# Altium schematic sheet POWER.SchDoc
size A2
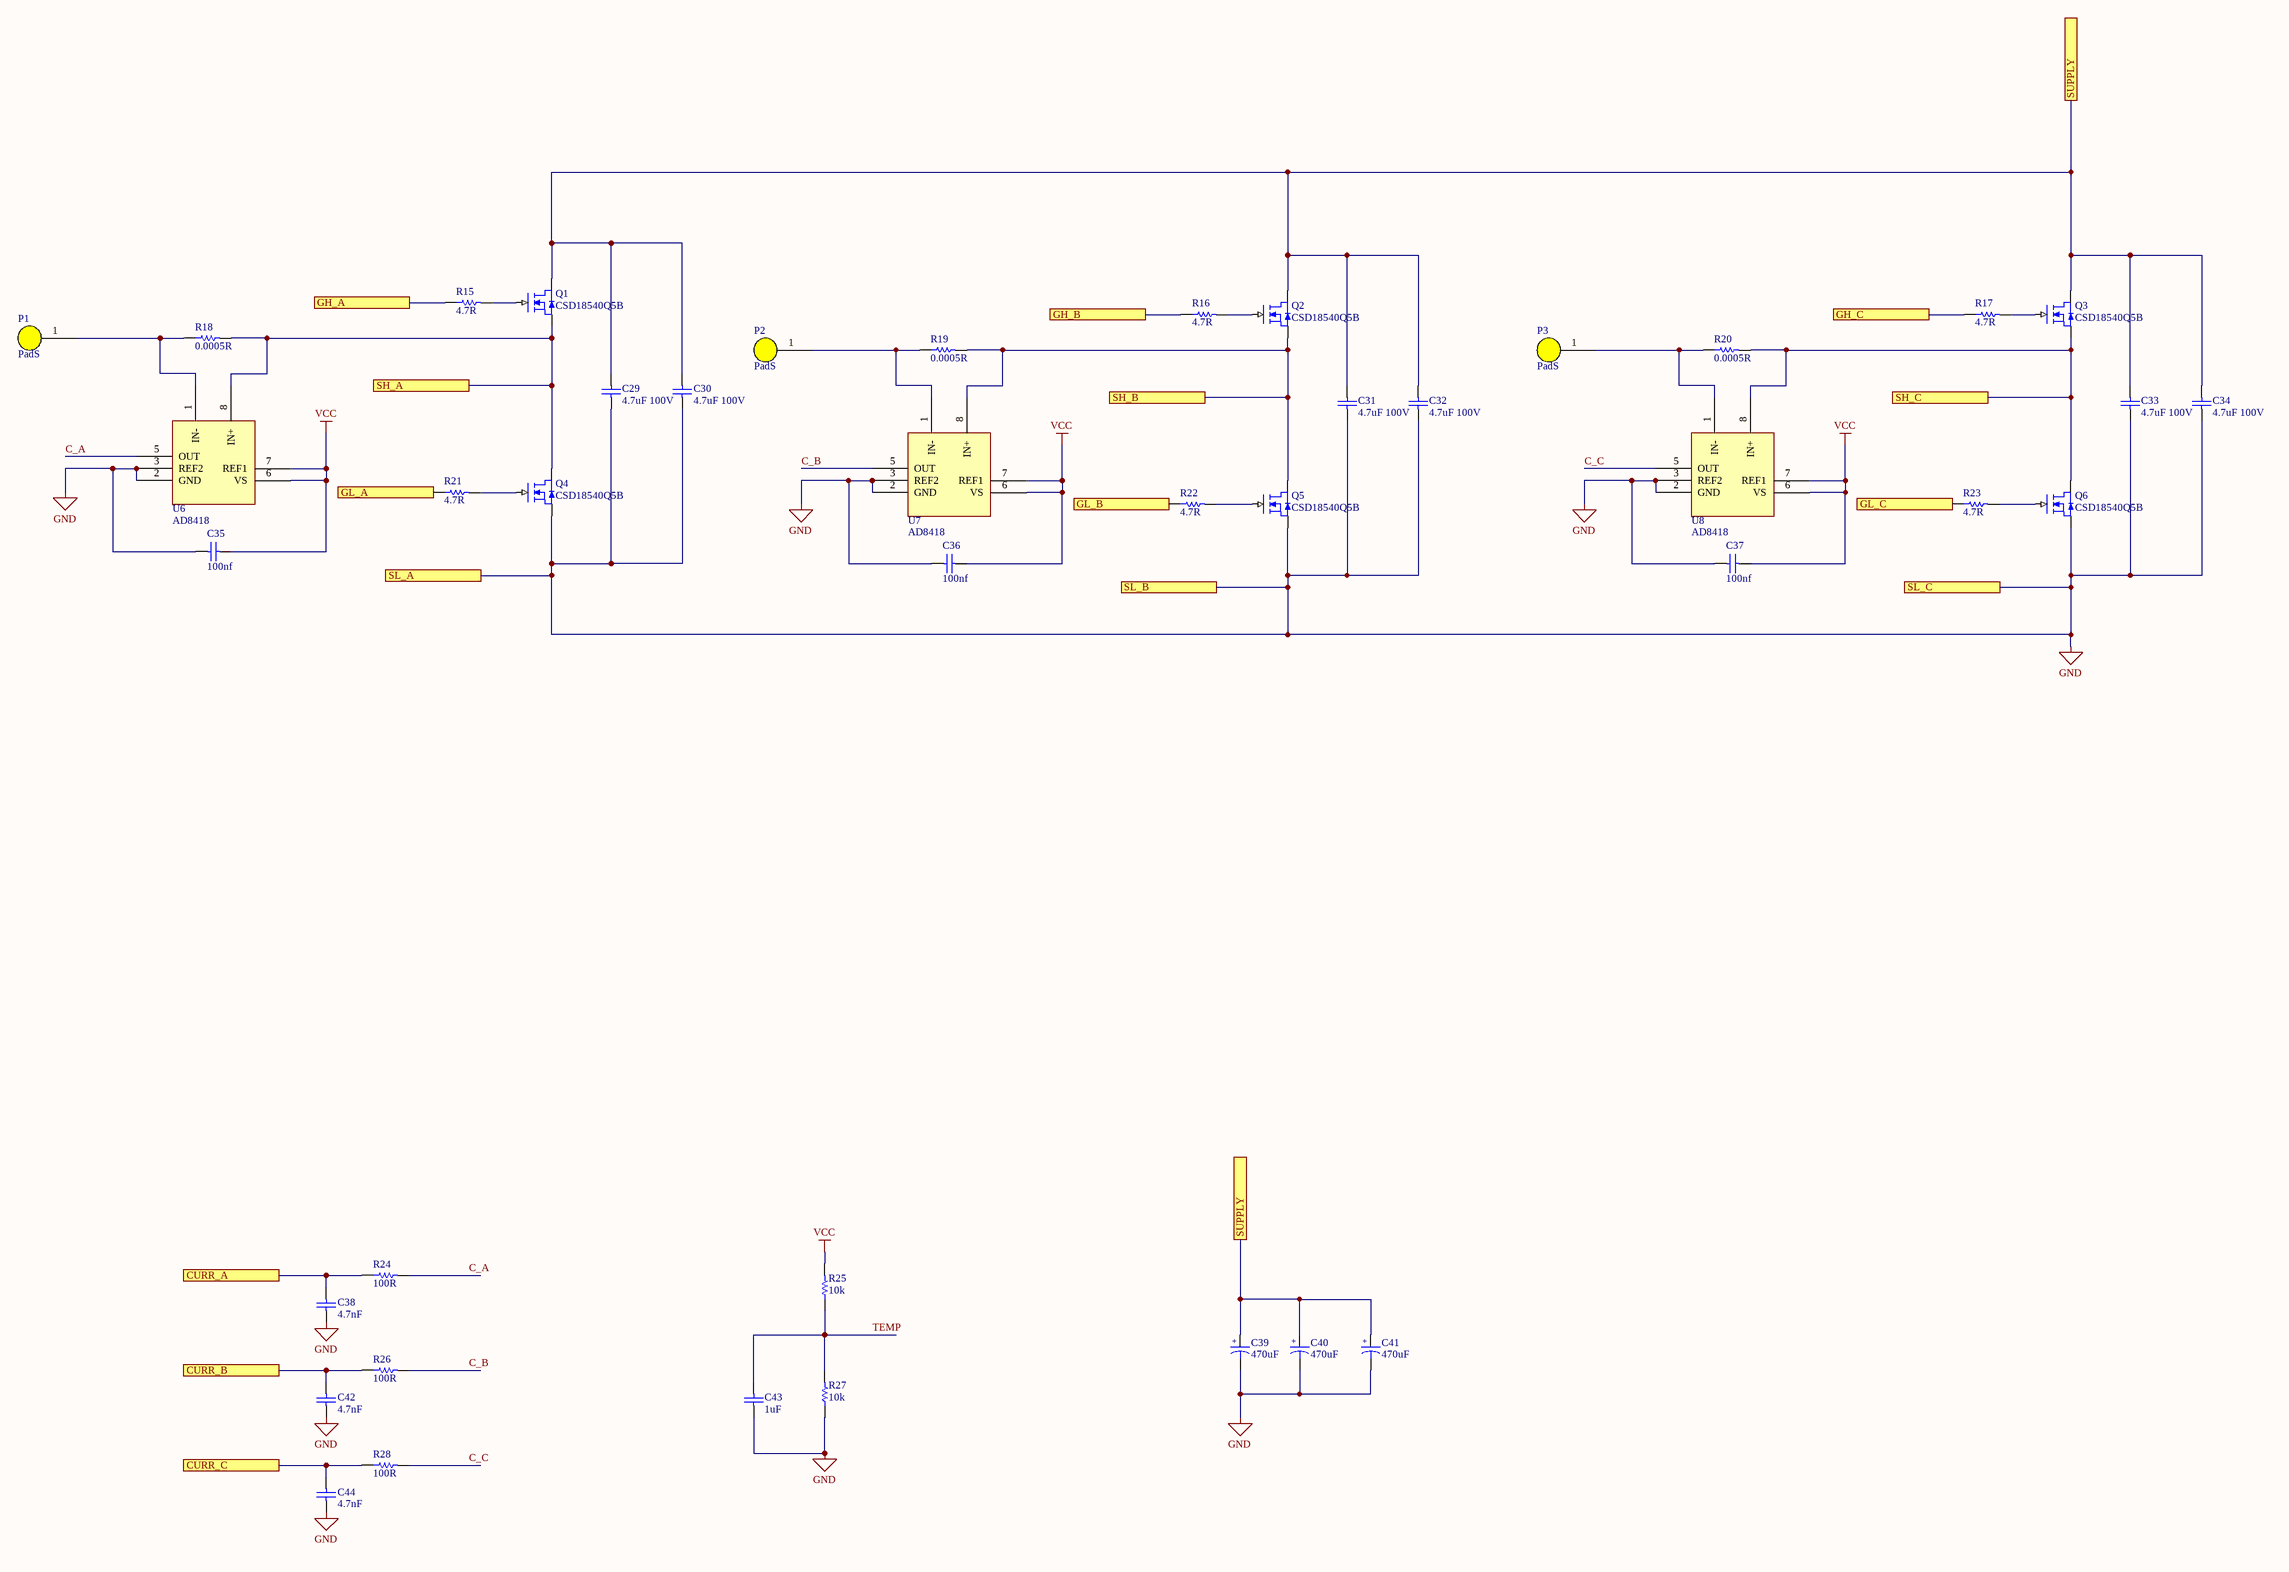
[diagram p0: POWER.SchDoc]

## Parts
C29  4.7uF 100V  [1210]
C30  4.7uF 100V  [1210]
C31  4.7uF 100V  [1210]
C32  4.7uF 100V  [1210]
C33  4.7uF 100V  [1210]
C34  4.7uF 100V  [1210]
C35  100nf  [0603-1]
C36  100nf  [0603-1]
C37  100nf  [0603-1]
C38  4.7nF  [0603-1]
C39  470uF  [大电容]
C40  470uF  [大电容]
C41  470uF  [大电容]
C42  4.7nF  [0603-1]
C43  1uF  [0603-1]
C44  4.7nF  [0603-1]
P1  PadS  [MOTOR_PAD]
P2  PadS  [MOTOR_PAD]
P3  PadS  [MOTOR_PAD]
Q1  CSD18540Q5B  [DFN5X6]
Q2  CSD18540Q5B  [DFN5X6]
Q3  CSD18540Q5B  [DFN5X6]
Q4  CSD18540Q5B  [DFN5X6]
Q5  CSD18540Q5B  [DFN5X6]
Q6  CSD18540Q5B  [DFN5X6]
R15  4.7R  [0603-1]
R16  4.7R  [0603-1]
R17  4.7R  [0603-1]
R18  0.0005R  [采样电阻0.0005R]
R19  0.0005R  [采样电阻0.0005R]
R20  0.0005R  [采样电阻0.0005R]
R21  4.7R  [0603-1]
R22  4.7R  [0603-1]
R23  4.7R  [0603-1]
R24  100R  [0603-1]
R25  10k  [0603-1]
R26  100R  [0603-1]
R27  10k  [0603-1]
R28  100R  [0603-1]
U6  AD8418  [SOP8-TJA1050]
U7  AD8418  [SOP8-TJA1050]
U8  AD8418  [SOP8-TJA1050]

## Ports
CURR_A, CURR_B, CURR_C, GH_A, GH_B, GH_C, GL_A, GL_B, GL_C, SH_A, SH_B, SH_C, SL_A, SL_B, SL_C, SUPPLY

## Nets
GND: C29.2 C30.2 C31.2 C32.2 C33.2 C34.2 C35.2 C36.2 C37.2 C38.1 C39.2 C40.2 C41.2 C42.1 C43.1 C44.1 Q4.1(S) Q5.1(S) Q6.1(S) R27.1 U6.2(GND) U6.3(REF2) U7.2(GND) U7.3(REF2) U8.2(GND) U8.3(REF2) ; port SL_A, port SL_B, port SL_C
VCC: C35.1 C36.1 C37.1 R25.2 U6.6(VS) U6.7(REF1) U7.6(VS) U7.7(REF1) U8.6(VS) U8.7(REF1)
C_A: R24.2 U6.5(OUT)
C_B: R26.2 U7.5(OUT)
C_C: R28.2 U8.5(OUT)
CURR_A: C38.2 R24.1 ; port CURR_A
CURR_B: C42.2 R26.1 ; port CURR_B
CURR_C: C44.2 R28.1 ; port CURR_C
GH_A: R15.1 ; port GH_A
GH_B: R16.1 ; port GH_B
GH_C: R17.1 ; port GH_C
GL_A: R21.1 ; port GL_A
GL_B: R22.1 ; port GL_B
GL_C: R23.1 ; port GL_C
SH_A: Q1.1(S) Q4.8(D) R18.2 U6.8(IN+) ; port SH_A
SH_B: Q2.1(S) Q5.8(D) R19.2 U7.8(IN+) ; port SH_B
SH_C: Q3.1(S) Q6.8(D) R20.2 U8.8(IN+) ; port SH_C
SUPPLY: C29.1 C30.1 C31.1 C32.1 C33.1 C34.1 C39.1 C40.1 C41.1 Q1.8(D) Q2.8(D) Q3.8(D) ; port SUPPLY
TEMP: C43.2 R25.1 R27.2
NetP1_1: P1.1 R18.1 U6.1(IN-)
NetP2_1: P2.1 R19.1 U7.1(IN-)
NetP3_1: P3.1 R20.1 U8.1(IN-)
NetQ1_4: Q1.4(G) R15.2
NetQ2_4: Q2.4(G) R16.2
NetQ3_4: Q3.4(G) R17.2
NetQ4_4: Q4.4(G) R21.2
NetQ5_4: Q5.4(G) R22.2
NetQ6_4: Q6.4(G) R23.2

## Notes on the sheet
- (in symbol CAP1) +

## Library data of the parts
C29-C38 C42-C44 = CAP: Capacitor; Value: 104; Published: 8-Jun-2000; LatestRevisionDate: 17-Jul-2002; LatestRevisionNote: Re-released for DXP Platform.; PackageReference: RAD-0.3; Publisher: Altium Limited
C39-C41 = CAP1
R15-R28 = RES: Resistor; Value: 1K; Published: 8-Jun-2000; Revision: July-2002: Re-released for DXP Platform.; Publisher: Altium Limited